# Altium schematic sheet Potard.SchDoc
size A
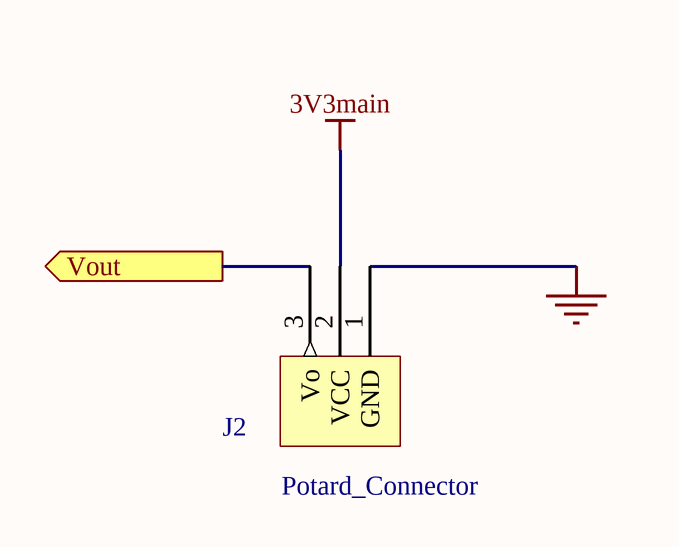
[diagram p0: Potard.SchDoc]

## Parts
J2  Potard_Connector  [POTARD CONNECTOR]

## Ports
Vout (out)

## Nets
3V3main: J2.2(VCC)
GND: J2.1(GND)
Vout: J2.3(Vo) ; port Vout

## Library data of the parts
J2 = Potard_Connector: Female Embase 3 contacts; fournisseur: Farnell; reffournisseur: 1845931; fabricant: TE CONNECTIVITY / AMP; reffabricant: 5-534237-1